# Altium schematic sheet LARIX_V5_2.SchDoc
size 409 x 282 mm; >DRAWING_NAME: LARIX_V5.sch; >LAST_DATE_TIME: 05.02.2016 10:43:53; >SHEET: 3; Sheet:: Sheet:; Legal Disclaimer: Legal Disclaimer; The information given in this document shall in no event be regarded as a guarantee of conditions or: The information given in this document shall in no event be regarded as a guarantee of conditions or; characteristics. With respect to any examples or hints given herein, any typical values stated herein and/or any: characteristics. With respect to any examples or hints given herein, any typical values stated herein and/or any; information regarding the application of the device, Infineon Technologies hereby disclaims any and all warranties: information regarding the application of the device, Infineon Technologies hereby disclaims any and all warranties; and liabilities of any kind, including without limitation, warranties of non-infringement of intellectual property rights: and liabilities of any kind, including without limitation, warranties of non-infringement of intellectual property rights; of any third party.: of any third party.
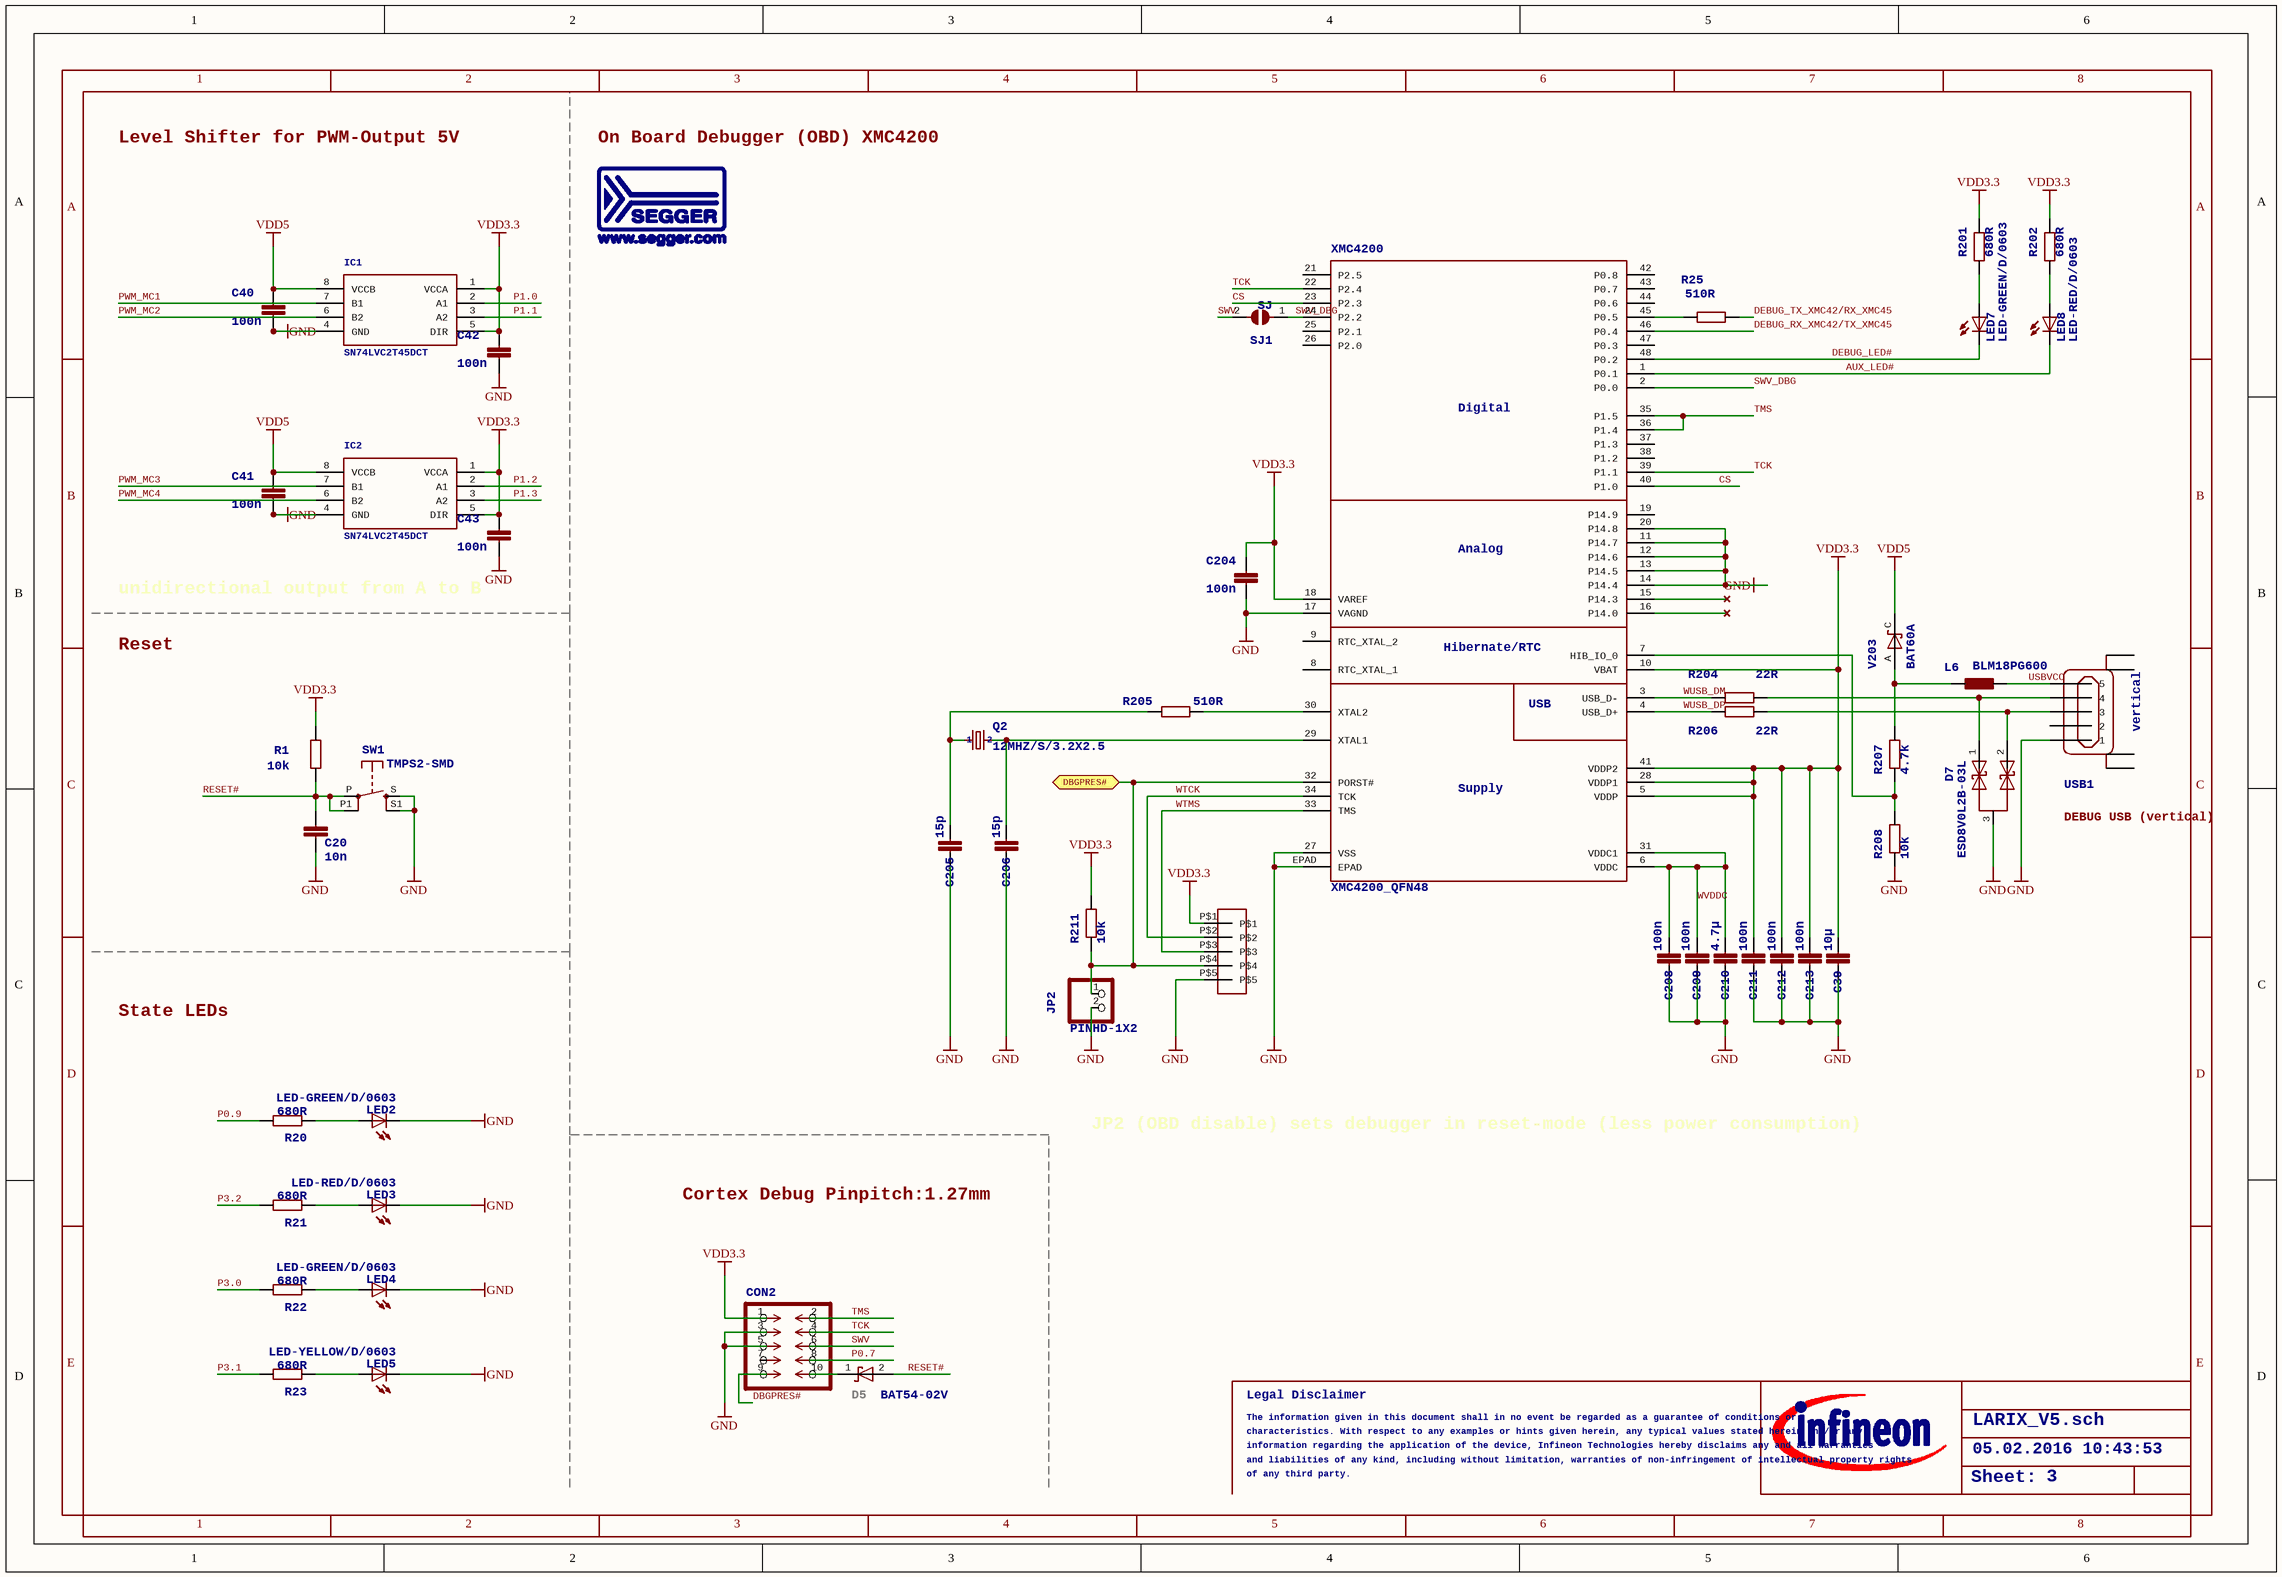
[diagram p0: LARIX_V5_2.SchDoc]

## Parts
C20  10n  [C0603]
C39  10µ  [C0805K]
C40  100n  [C0603]
C41  100n  [C0603]
C42  100n  [C0603]
C43  100n  [C0603]
C204  >NAME: C204  [C0402]  (hidden comment: 100n)
C205  15p  [C0402]
C206  15p  [C0402]
C208  100n  [C0402]
C209  100n  [C0402]
C210  4.7µ  [C0805K]
C211  100n  [C0402]
C212  100n  [C0402]
C213  100n  [C0402]
CON2  FTSH-105-01-F-D-K  [FTSH-105-01-F-D-K]  (value not drawn)
D5  BAT54-02V  [SC79]
D7  ESD8V0L2B-03L  [TSLP-3-1]
IC1  >NAME: IC1  [DCT_R-PDSO-G8]  (hidden comment: SN74LVC2T45DCT)
IC2  >NAME: IC2  [DCT_R-PDSO-G8]  (hidden comment: SN74LVC2T45DCT)
JP2  PINHD-1X2  [1X02]
L6  BLM18PG600  [L1608]
LED2  >NAME: LED2  [CHIPLED_0603]  (hidden comment: LED-GREEN/D/0603)
LED3  >NAME: LED3  [CHIPLED_0603]  (hidden comment: LED-RED/D/0603)
LED4  >NAME: LED4  [CHIPLED_0603]  (hidden comment: LED-GREEN/D/0603)
LED5  >NAME: LED5  [CHIPLED_0603]  (hidden comment: LED-YELLOW/D/0603)
LED7  >NAME: LED7  [CHIPLED_0603]  (hidden comment: LED-GREEN/D/0603)
LED8  >NAME: LED8  [CHIPLED_0603]  (hidden comment: LED-RED/D/0603)
Q2  >NAME: Q2  [32X25_4PAD]  (hidden comment: 12MHZ/S/3.2X2.5)
R1  10k  [R0603]
R20  >NAME: R20  [R0603]  (hidden comment: 680R)
R21  >NAME: R21  [R0603]  (hidden comment: 680R)
R22  >NAME: R22  [R0603]  (hidden comment: 680R)
R23  >NAME: R23  [R0603]  (hidden comment: 680R)
R25  510R  [R0402]
R201  >NAME: R201  [R0603]  (hidden comment: 680R)
R202  >NAME: R202  [R0603]  (hidden comment: 680R)
R204  22R  [R0402]
R205  510R  [R0603]
R206  22R  [R0402]
R207  >NAME: R207  [R0402]  (hidden comment: 4.7k)
R208  >NAME: R208  [R0402]  (hidden comment: 10k)
R211  >NAME: R211  [R0402]  (hidden comment: 10k)
SJ1  >NAME: SJ1  [SJ]  (hidden comment: SJ)
SW1  >NAME: SW1  [FSM2JSMA]  (hidden comment: TMPS2-SMD)
U$9  127MARKED  [PINHEAD_127]  (value not drawn)
U$11  SEGGER.L_100  [LOGO_100]  (value not drawn)
USB1  vertical  [USBVERTICAL]
V203  >NAME: V203  [SOD323-R]  (hidden comment: BAT60A)
XMC4200  >NAME: XMC4200  [QFN-48-7X7]  (hidden comment: XMC4200_QFN48)

## Ports
DBGPRES#

## Nets
GND: C20.2 C39.2 C40.2 C41.2 C42.2 C43.2 C204.2 C205.2 C206.2 C208.2 C209.2 C210.2 C211.2 C212.2 C213.2 CON2.3 CON2.5 D7.3 IC1.4(GND) IC2.4(GND) JP2.2 LED2.C LED3.C LED4.C LED5.C R208.1 SW1.S SW1.S1(S) U$9.P$5 USB1.1 XMC4200.11(P14.7) XMC4200.12(P14.6) XMC4200.13(P14.5) XMC4200.14(P14.4) XMC4200.17(VAGND) XMC4200.20(P14.8) XMC4200.27(VSS) XMC4200.EPAD
VDD3.3: C39.1 C42.1 C43.1 C204.1 C211.1 C212.1 C213.1 CON2.1 IC1.1(VCCA) IC1.5(DIR) IC2.1(VCCA) IC2.5(DIR) R1.2 R201.1 R202.1 R211.2 U$9.P$1 XMC4200.5(VDDP) XMC4200.10(VBAT) XMC4200.18(VAREF) XMC4200.28(VDDP1) XMC4200.41(VDDP2)
VDD5: C40.1 C41.1 IC1.8(VCCB) IC2.8(VCCB) V203.C
AUX_LED#: LED8.C XMC4200.1(P0.1)
CS: XMC4200.23(P2.3) XMC4200.40(P1.0)
DBGPRES#: JP2.1 R211.1 U$9.P$4 XMC4200.32(PORST#) ; port DBGPRES#
DBGPRES#: CON2.9  [a separate net that carries the same name]
DEBUG_LED#: LED7.C XMC4200.48(P0.2)
DEBUG_RX_XMC42/TX_XMC45: XMC4200.46(P0.4)
DEBUG_TX_XMC42/RX_XMC45: R25.2
P0.7: CON2.8
P0.9: R20.2
P1.0: IC1.2(A1)
P1.1: IC1.3(A2)
P1.2: IC2.2(A1)
P1.3: IC2.3(A2)
P3.0: R22.2
P3.1: R23.2
P3.2: R21.2
PWM_MC1: IC1.7(B1)
PWM_MC2: IC1.6(B2)
PWM_MC3: IC2.7(B1)
PWM_MC4: IC2.6(B2)
RESET#: C20.1 D5.2(A) R1.1 SW1.P SW1.P1(P)
SWV: CON2.6 SJ1.2
SWV_DBG: SJ1.1 XMC4200.2(P0.0) XMC4200.24(P2.2)
TCK: CON2.4 XMC4200.22(P2.4) XMC4200.39(P1.1)
TMS: CON2.2 XMC4200.35(P1.5) XMC4200.36(P1.4)
USBVCC: L6.1 USB1.5
WTCK: U$9.P$2 XMC4200.34(TCK)
WTMS: U$9.P$3 XMC4200.33(TMS)
WUSB_DM: R204.1 XMC4200.3(USB_D-)
WUSB_DP: R206.1 XMC4200.4(USB_D+)
WVDDC: C208.1 C209.1 C210.1 XMC4200.6(VDDC) XMC4200.31(VDDC1)
NetC205_1: C205.1 Q2.1 R205.2
NetC206_1: C206.1 Q2.3 XMC4200.29(XTAL1)
NetCON2_10: CON2.10 D5.1(C)
NetD7_1: D7.1 R204.2 USB1.4
NetD7_2: D7.2 R206.2 USB1.3+(3)
NetL6_2: L6.2 R207.2 V203.A
NetLED2_A: LED2.A R20.1
NetLED3_A: LED3.A R21.1
NetLED4_A: LED4.A R22.1
NetLED5_A: LED5.A R23.1
NetLED7_A: LED7.A R201.2
NetLED8_A: LED8.A R202.2
NetR25_1: R25.1 XMC4200.45(P0.5)
NetR205_1: R205.1 XMC4200.30(XTAL2)
NetR207_1: R207.1 R208.2 XMC4200.7(HIB_IO_0)

Not connected (* = marked no-connect by the designer): CON2 7; USB1 2 P$1(PGH1) P$2(PGH2) P$3(PGH3) P$4(PGH4); XMC4200 8(RTC_XTAL_1) 9(RTC_XTAL_2) 15(P14.3) 16(P14.0) 19(P14.9) 21(P2.5) 25(P2.1) 26(P2.0) 37(P1.3) 38(P1.2) 42(P0.8) 43(P0.7) 44(P0.6) 47(P0.3)

## Notes on the sheet
- Level Shifter for PWM-Output 5V
- On Board Debugger (OBD) XMC4200
- unidirectional output from A to B
- Reset
- DEBUG USB
  (vertical)
- State LEDs
- JP2 (OBD disable) sets debugger in reset-mode
  (less power consumption)
- Cortex Debug
  Pinpitch:1.27mm
- (near D5) D5
- 1
- 2
- 3
- 4
- 5
- 6
- 7
- 8
- A
- B
- C
- D
- E

## Library data of the parts
C20 C40-C43 = C-EUC0603: <B>CAPACITOR</B>, European symbol
C39 C210 = C-EUC0805K: <B>CAPACITOR</B>, European symbol
C204-C206 C208 C209 C211-C213 = C-EUC0402
  C204: >VALUE: 100n
JP2 = PINHD-1X2: <b>PIN HEADER</b>
L6 = L_EU_L0603
LED2-LED5 LED7 LED8 = LEDCHIPLED_0603: <b>LED</b><p> / <u>OSRAM</u>:<br> / - <u>CHIPLED</u><br> / LG R971, LG N971, LY N971, LG Q971, LY Q971, LO R971, LY R971 / LH N974, LH R974<br> / LS Q976, LO Q976, LY Q976<br> / LO Q996<br> / - <u>Hyper CHIPLED</u><br> / LW Q18S<br> / LB Q993, LB Q99A, LB R99A<br> / - <u>SideLED</u><br> / LS A670, LO A670, LY A670, LG A670, LP A670<br> / LB A673, LV A673, LT A673, LW A673<br> / LH A674<br> / LY A675<br> / LS A676, LA A676, LO A676, LY A676, LW A676<br> / LS A679, LY A679, LG A679<br> / -  <u>Hyper Micro SIDELED®</u><br> / LS Y876, LA Y876, LO Y876, LY Y876<br> / LT Y87S<br> / - <u>SmartLED</u><br> / LW L88C, LW L88S<br> / LB L89C, LB L89S, LG L890<br> / LS L89K, LO L89K, LY L89K<br> / LS L896, LA L896, LO L896, LY L896<br> / - <u>TOPLED</u><br> / LS T670, LO T670, LY T670, LG T670, LP T670<br> / LSG T670, LSP T670, LSY T670, LOP T670, LYG T670<br> / LG T671, LOG T671, LSG T671<br> / LB T673, LV T673, LT T673, LW T673<br> / LH T674<br> / LS T676, LA T676, LO T676, LY T676, LB T676, LH T676, LSB T676, LW T676<br> / LB T67C, LV T67C, LT T67C, LS T67K, LO T67K, LY T67K, LW E67C<br> / LS E67B, LA E67B, LO E67B, LY E67B, LB E67C, LV E67C, LT E67C<br> / LW T67C<br> / LS T679, LY T679, LG T679<br> / LS T770, LO T770, LY T770, LG T770, LP T770<br> / LB T773, LV T773, LT T773, LW T773<br> / LH T774<br> / LS E675, LA E675, LY E675, LS T675<br> / LS T776, LA T776, LO T776, LY T776, LB T776<br> / LHGB T686<br> / LT T68C, LB T68C<br> / - <u>Hyper Mini TOPLED®</u><br> / LB M676<br> / - <u>Mini TOPLED Santana®</u><br> / LG M470<br> / LS M47K, LO M47K, LY M47K<br> / <p> / Source: http://www.osram.convergy.de/
  LED2 LED4 LED7: >VALUE: LED-GREEN/D/0603
  LED3 LED8: >VALUE: LED-RED/D/0603
  LED5: >VALUE: LED-YELLOW/D/0603
Q2 = NX3225_2: >VALUE: 12MHZ/S/3.2X2.5; 1: 1; 2: 2
R1 = R-EU_R0603: <B>RESISTOR</B>, European symbol
R20-R23 R201 R202 R205 = R-EU_R0603
  R20-R23 R201 R202: >VALUE: 680R
R25 R204 R206-R208 R211 = R-EU_R0402
  R207: >VALUE: 4.7k
  R208 R211: >VALUE: 10k
SJ1 = SJ: SMD solder <b>JUMPER</b>; >VALUE: SJ
SW1 = FSM2JSMA: >VALUE: TMPS2-SMD
USB1 = MICRO_USB_VERTICAL
V203 = BAT60: >VALUE: BAT60A
IC1 IC2 = SN74LVC2T45DCT: >VALUE: SN74LVC2T45DCT
XMC4200 = XMC4200_QFN48: >VALUE: XMC4200_QFN48; USB: USB; Supply: Supply; Analog: Analog; Digital: Digital; Hibernate/RTC: Hibernate/RTC